# EAGLE design PCB-PAYLOAD-MIRRORED_FINAL (EAGLE 7.6.0)
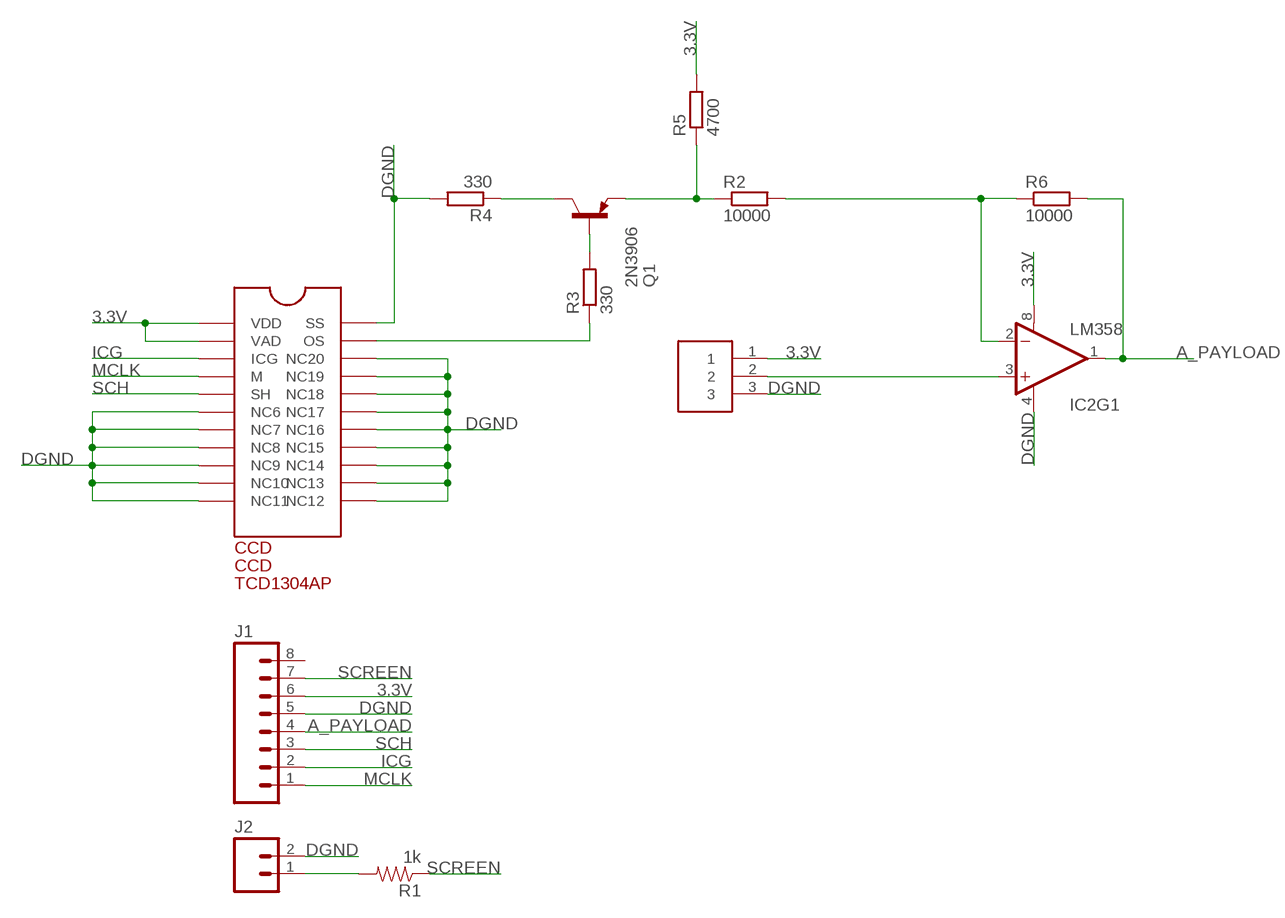
[diagram p0: schematic, sheet 1]

## Parts
CCD  CCD  [CCD]
IC2  LM358  [DIP08]
J1  M08  [1X08_ROUND]
J2  M02PTH  [1X02]
Q1  2N3906  [TO92]
R1  1k  1KOHM-1/4W-5%(PTH)  [AXIAL-0.3]
R2  10000  R-EU_0204/5  [0204/5]
R3  330  R-EU_0204/5  [0204/5]
R4  330  R-EU_0204/5  [0204/5]
R5  4700  R-EU_0204/5  [0204/5]
R6  10000  R-EU_0204/5  [0204/5]
U$2  TRIMPOT_DEVICE  [TRIM_POT_PACKAGE]

## Nets
3.3V: CCD.VAD CCD.VDD IC2.8(V+) J1.6 R5.2 U$2.1
A_PAYLOAD: IC2.1(OUT) J1.4 R6.2
DGND: CCD.NC6 CCD.NC7 CCD.NC8 CCD.NC9 CCD.NC10 CCD.NC11 CCD.NC12 CCD.NC13 CCD.NC14 CCD.NC15 CCD.NC16 CCD.NC17 CCD.NC18 CCD.NC19 CCD.NC20 CCD.SS IC2.4(V-) J1.5 J2.2 R4.2 U$2.3
ICG: CCD.ICG J1.2
MCLK: CCD.M J1.1
N$1: Q1.1(C) R4.1
N$2: CCD.OS R3.1
N$3: IC2.2(-IN) R2.2 R6.1
N$4: Q1.2(B) R3.2
N$5: Q1.3(E) R2.1 R5.1
N$7: IC2.3(+IN) U$2.2
N$8: J2.1 R1.P$2
SCH: CCD.SH J1.3
SCREEN: J1.7 R1.P$1
Unconnected: IC2.5(+IN) IC2.6(-IN) IC2.7(OUT) J1.8

## Library data of the parts
CCD = CCD:CCD
IC2 = SparkFun-AnalogIC:LM358: Jellybean op-amp; PROD_ID: IC-09172
J1 = SparkFun-Connectors:M08: Header 8 Standard 8-pin 0.1" header. Use with straight break away headers (SKU : PRT-00116), right angle break away headers (PRT-00553), swiss pins (PRT-00743), machine pins (PRT-00117), and female headers (PRT-00115).; PROD_ID: CONN-08437
J2 = SparkFun-Connectors:M02: Standard 2-pin 0.1" header. Use with - straight break away headers ( PRT-00116) - right angle break away headers (PRT-00553) - swiss pins (PRT-00743) - machine pins (PRT-00117) - female headers (PRT-00115) Molex polarized connector foot print use with: PRT-08233 with associated crimp pins and housings. 2.54_SCREWTERM for use with PRT-10571. 3.5mm Screw Terminal footprints for PRT-08084 5mm Screw Terminal footprints for use with PRT-08432
Q1 = transistor-pnp:2N3906: PNP Transistor
R1 = SparkFun-Resistors:1KOHM-1/4W-5%(PTH): RES-08380; PROD_ID: RES-08380
R2-R6 = resistor:R-EU_: RESISTOR, European symbol
U$2 = TRIMPOT_2Kohm:TRIMPOT_DEVICE

## Board
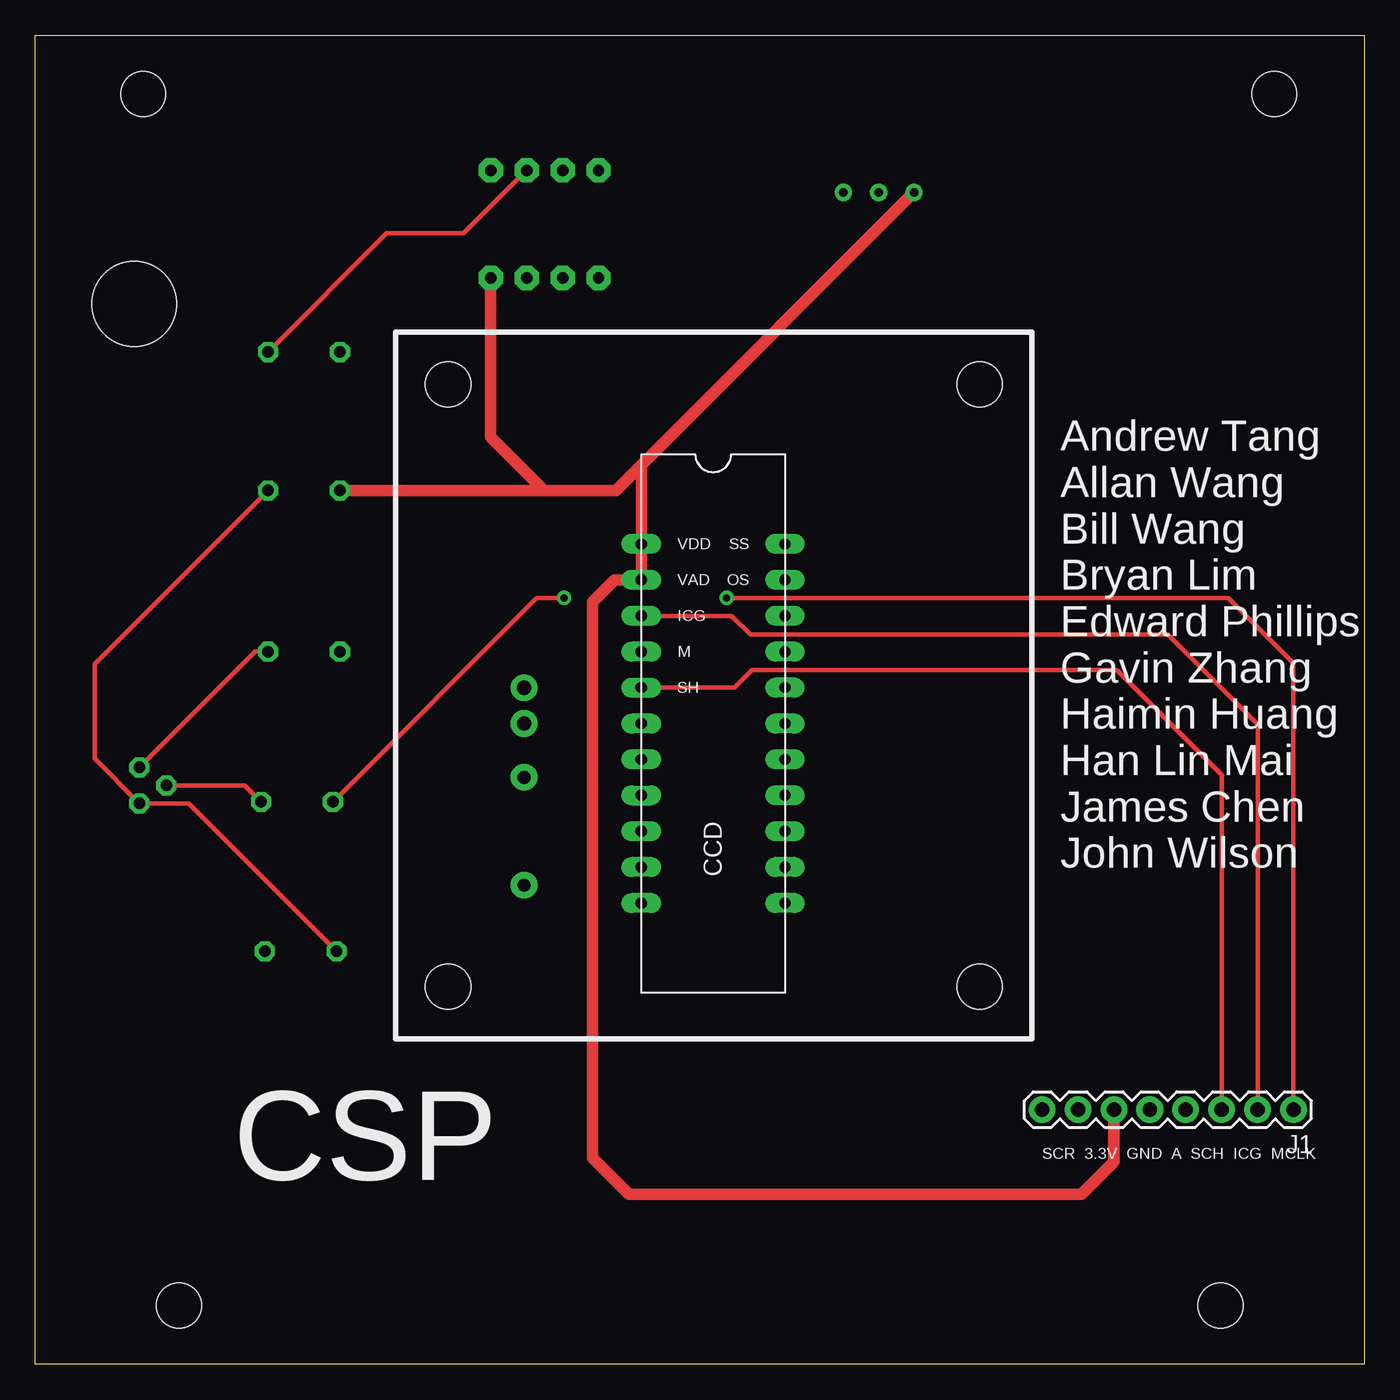
[diagram p1: board, top side]
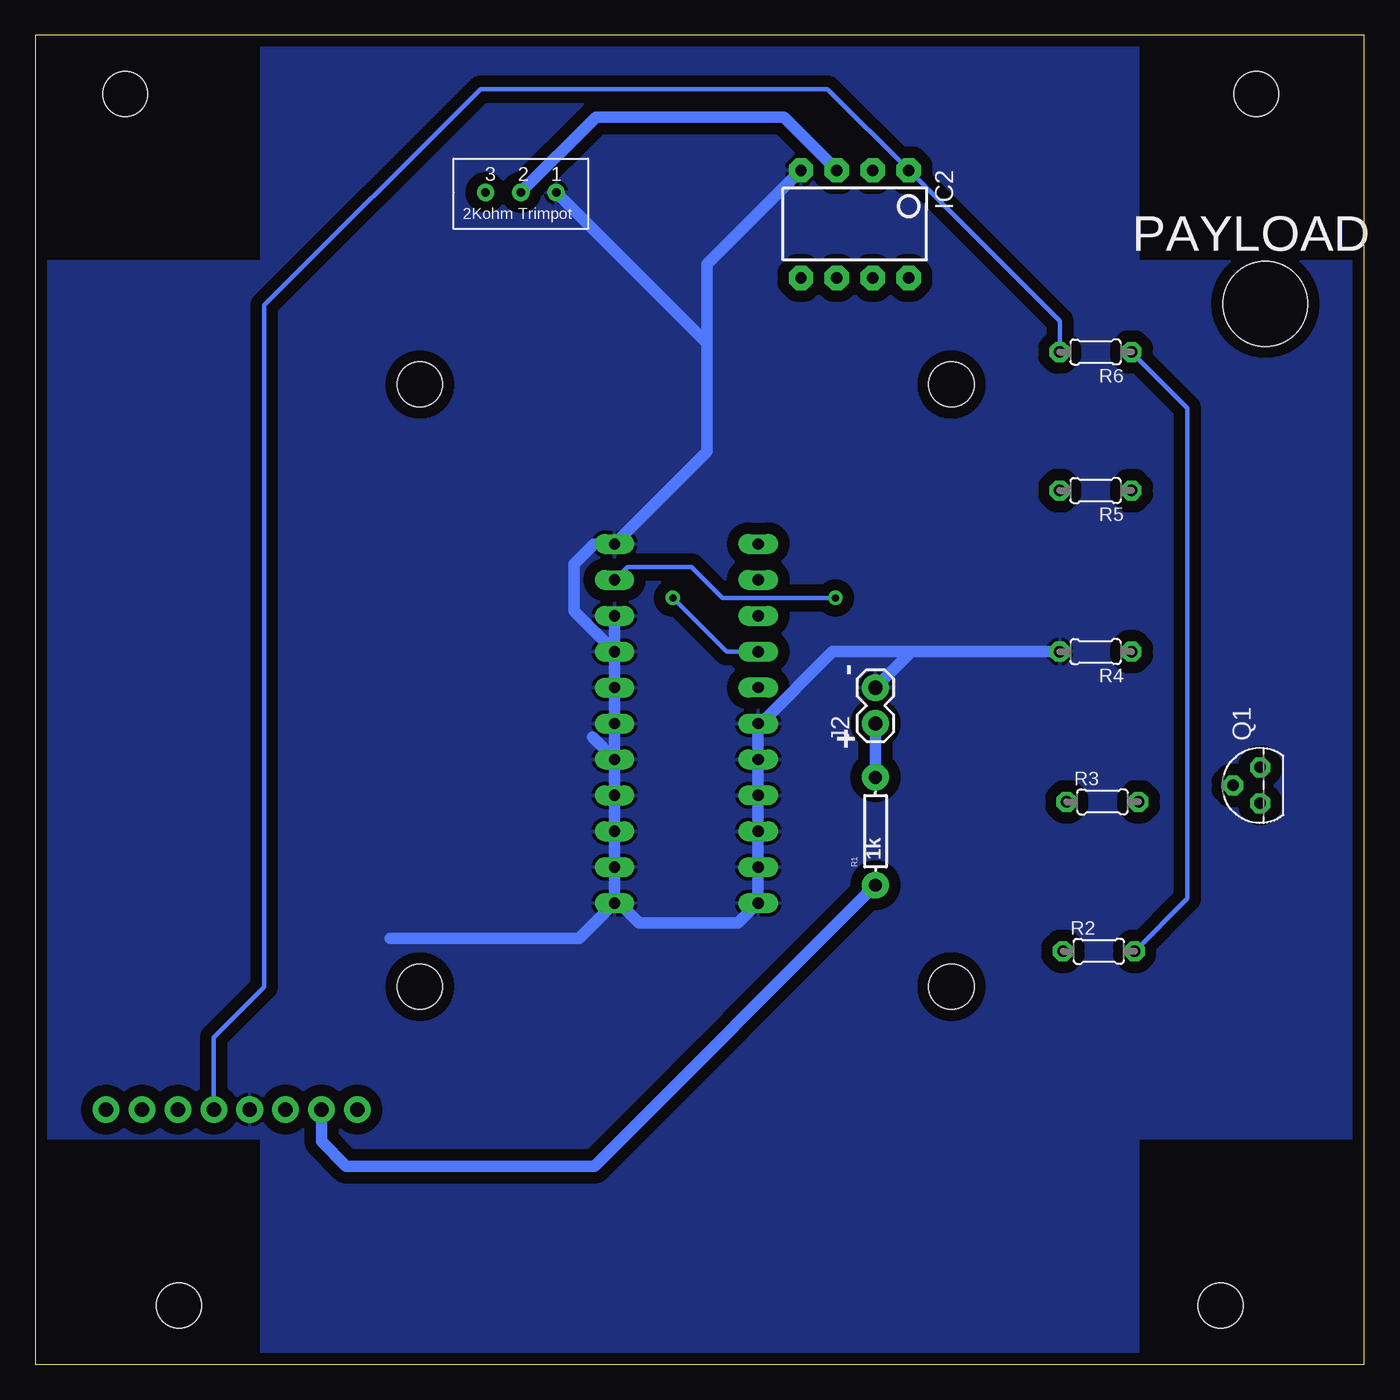
[diagram p2: board, bottom side, seen from below]

Size 94 x 94 mm. Coordinates in mm from the lower left corner, seen from the top.
Outline: 0,0 0,94 94,94 94,0 0,0
Copper layers (1*16): Top 0.035mm / dielectric 1.5mm / Bottom 0.035mm
Design rules "SparkFun": minimum track width 8mil, minimum drill 20mil, track to track 8mil, track to pad 8mil, pad to pad 8mil, via to via 8mil, smd to smd 8mil, copper to edge 8mil, drill to drill 8mil, minimum pad ring 12mil, minimum via ring 10mil, stop-mask expansion 4mil, vias tented up to drill 20mil, thermal gap 10mil
Holes 3.18 mm at 7.63,89.86 87.64,89.86 83.83,4.13 10.17,4.13
Holes 3.2 mm at 29.2,26.7 66.8,26.7 66.8,69.3 29.2,69.3
Holes 6 mm at 7,75

### Footprints (pad centres in the part's own frame; a part is rotated, then mirrored left to right if it is on the bottom)
CCD = drill 0.8 long: ICG -5.08,7.62; M -5.08,5.08; NC6 -5.08,0; NC7 -5.08,-2.54; NC8 -5.08,-5.08; NC9 -5.08,-7.62; NC10 -5.08,-10.16; NC11 -5.08,-12.7; NC12 5.08,-12.7; NC13 5.08,-10.16; NC14 5.08,-7.62; NC15 5.08,-5.08; NC16 5.08,-2.54; NC17 5.08,0; NC18 5.08,2.54; NC19 5.08,5.08; NC20 5.08,7.62; OS 5.08,10.16; SH -5.08,2.54; SS 5.08,12.7; VAD -5.08,10.16; VDD -5.08,12.7
DIP08 = drill 0.813 pad 1.727 octagon: 1 -3.81,-3.81; 2 -1.27,-3.81; 3 1.27,-3.81; 4 3.81,-3.81; 5 3.81,3.81; 6 1.27,3.81; 7 -1.27,3.81; 8 -3.81,3.81
1X08_ROUND = drill 1.016 pad 1.88: 1 0,0; 2 2.54,0; 3 5.08,0; 4 7.62,0; 5 10.16,0; 6 12.7,0; 7 15.24,0; 8 17.78,0
1X02 = drill 1.016 pad 1.88: 1 0,0; 2 2.54,0
TO92 = drill 0.813 octagon: 1 1.27,0; 2 0,1.905; 3 -1.27,0
AXIAL-0.3 = drill 0.9 pad 1.88: P$1 -3.81,0; P$2 3.81,0
0204/5 = drill 0.813 octagon: 1 -2.54,0; 2 2.54,0
TRIM_POT_PACKAGE = drill 0.6: 1 7.25,2.4; 2 4.75,2.4; 3 2.25,2.4

### Placement (x,y rotation side)
CCD  47.95,45.32 0 top
IC2  36.03,80.65 180 bottom
J1  89,18 180 top
J2  34.57,45.32 90 bottom
Q1  7.36,40.94 90 bottom
R1  34.57,37.7 90 bottom
R2  18.77,29.21 0 bottom
R3  18.51,39.78 0 bottom
R4  19,50.4 180 bottom
R5  19,61.8 180 bottom
R6  19,71.6 180 bottom
U$2  54.91,85.29 180 bottom

### Tracks (layer width: path | path; a pad name or v marks a point on that pad's centre or on a via)
3.3V
  Top 0.813: U$2.1 42.87,63.6 | 42.87,63.6 CCD.VDD CCD.VAD 40.98,55.48 39.4,53.9 39.4,14.6 42,12 74,12 76.3,14.3 J1.6 | R5.2 36,61.8 | 36,61.8 41.07,61.8 42.87,63.6 | IC2.8 32.22,65.58 36,61.8
A_PAYLOAD
  Bottom 0.305: R6.2 21.54,73.78 IC2.1 37.96,90.2 62.5,90.2 77.8,74.9 77.8,26.7 81.39,23.11 81.38,23.1 J1.4
DGND
  Bottom 0.813: CCD.NC16 CCD.NC12 | CCD.NC12 52.72,32.62 51.3,31.2 44.29,31.2 CCD.NC11 CCD.NC6 42.68,45.32 37.6,50.4 32.03,50.4 | CCD.NC16 CCD.NC19 | CCD.NC19 CCD.NC20 | 46.5,72.23 46.5,77.8 IC2.4 | 46.5,72.23 46.5,64.55 CCD.SS 54.48,58.02 55.9,56.6 55.9,53.27 CCD.NC19 | CCD.NC16 54.6,44.35 | U$2.3 46.5,72.23 | 68.9,30.1 55.55,30.1 CCD.NC12 | 32.03,50.4 R4.2 | J2.2 32.03,50.4
  pour Bottom (isolate 0.813): 0,78 16,78 16,94 78,94 78,78 94,78 94,16 78,16 78,0 16,0 16,16 0,16
ICG
  Top 0.305: CCD.ICG 49.26,52.94 50.6,51.6 80.1,51.6 86.46,45.24 J1.2
MCLK  (via drill 0.51)
  Top 0.305: v48.9,54.2 84.4,54.2 89,49.6 J1.1
  Bottom 0.305: CCD.M 45.1,50.4 v48.9,54.2
N$1
  Top 0.305: Q1.1 15.55,50.4 R4.1
N$2  (via drill 0.51)
  Top 0.305: R3.1 35.47,54.2 v37.4,54.2
  Bottom 0.305: v37.4,54.2 45.4,54.2 47.6,56.4 52.11,56.4 CCD.OS
N$3
  Top 0.305: R6.1 24.86,80 30.3,80 IC2.2
  Bottom 0.305: R2.2 12.5,32.94 12.5,67.64 R6.1
N$4
  Top 0.305: R3.2 14.81,40.94 Q1.2
N$5
  Top 0.305: R5.1 4.2,49.54 4.2,42.83 Q1.3 10.85,39.67 R2.1
N$7
  Bottom 0.813: U$2.2 54.35,88.2 41.04,88.2 IC2.3
N$8
  Bottom 0.813: J2.1 R1.P$2
SCH
  Top 0.305: CCD.SH 49.46,47.86 50.7,49.1 76.5,49.1 83.92,41.68 J1.3
SCREEN
  Bottom 0.813: R1.P$1 54.46,14 72,14 73.76,15.76 J1.7

### Text on the board
tPlace: Andrew Tang / Allan Wang / Bill Wang / Bryan Lim / Edward Phillips / Gavin Zhang / Haimin Huang / Han Lin Mai / James Chen / John Wilson | SCR 3.3V GND A SCH ICG MCLK | CSP
bPlace: PAYLOAD | - | +